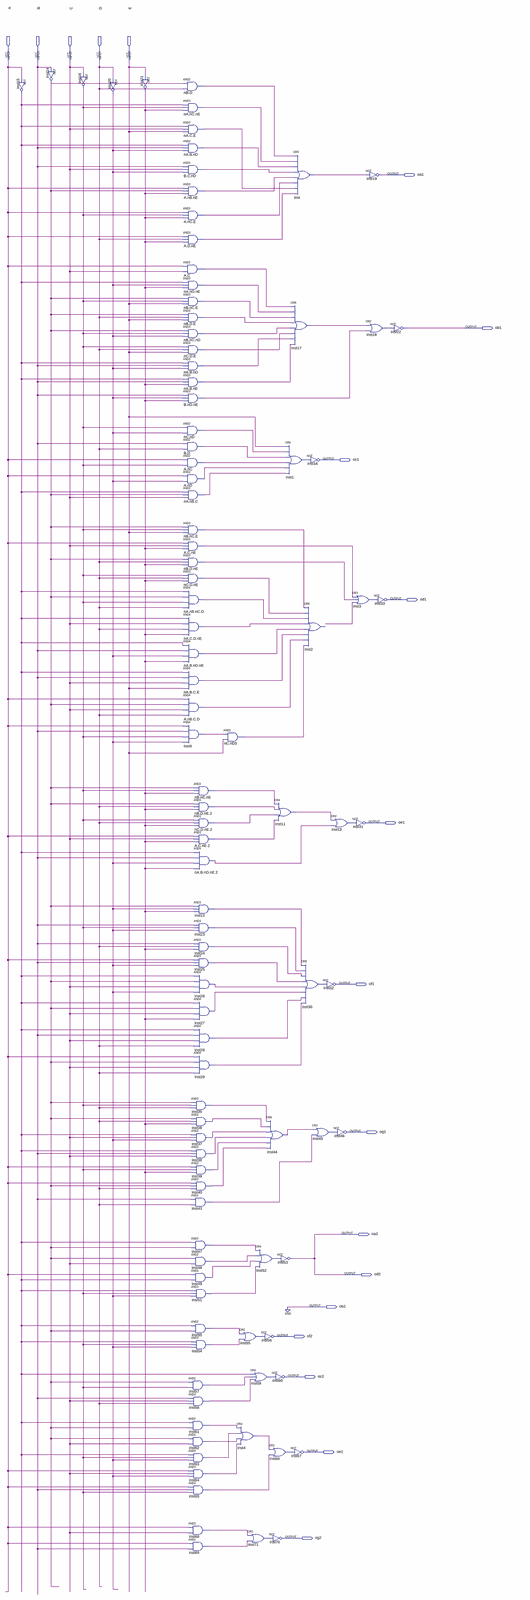
[diagram p0: schematic sheet, whole]
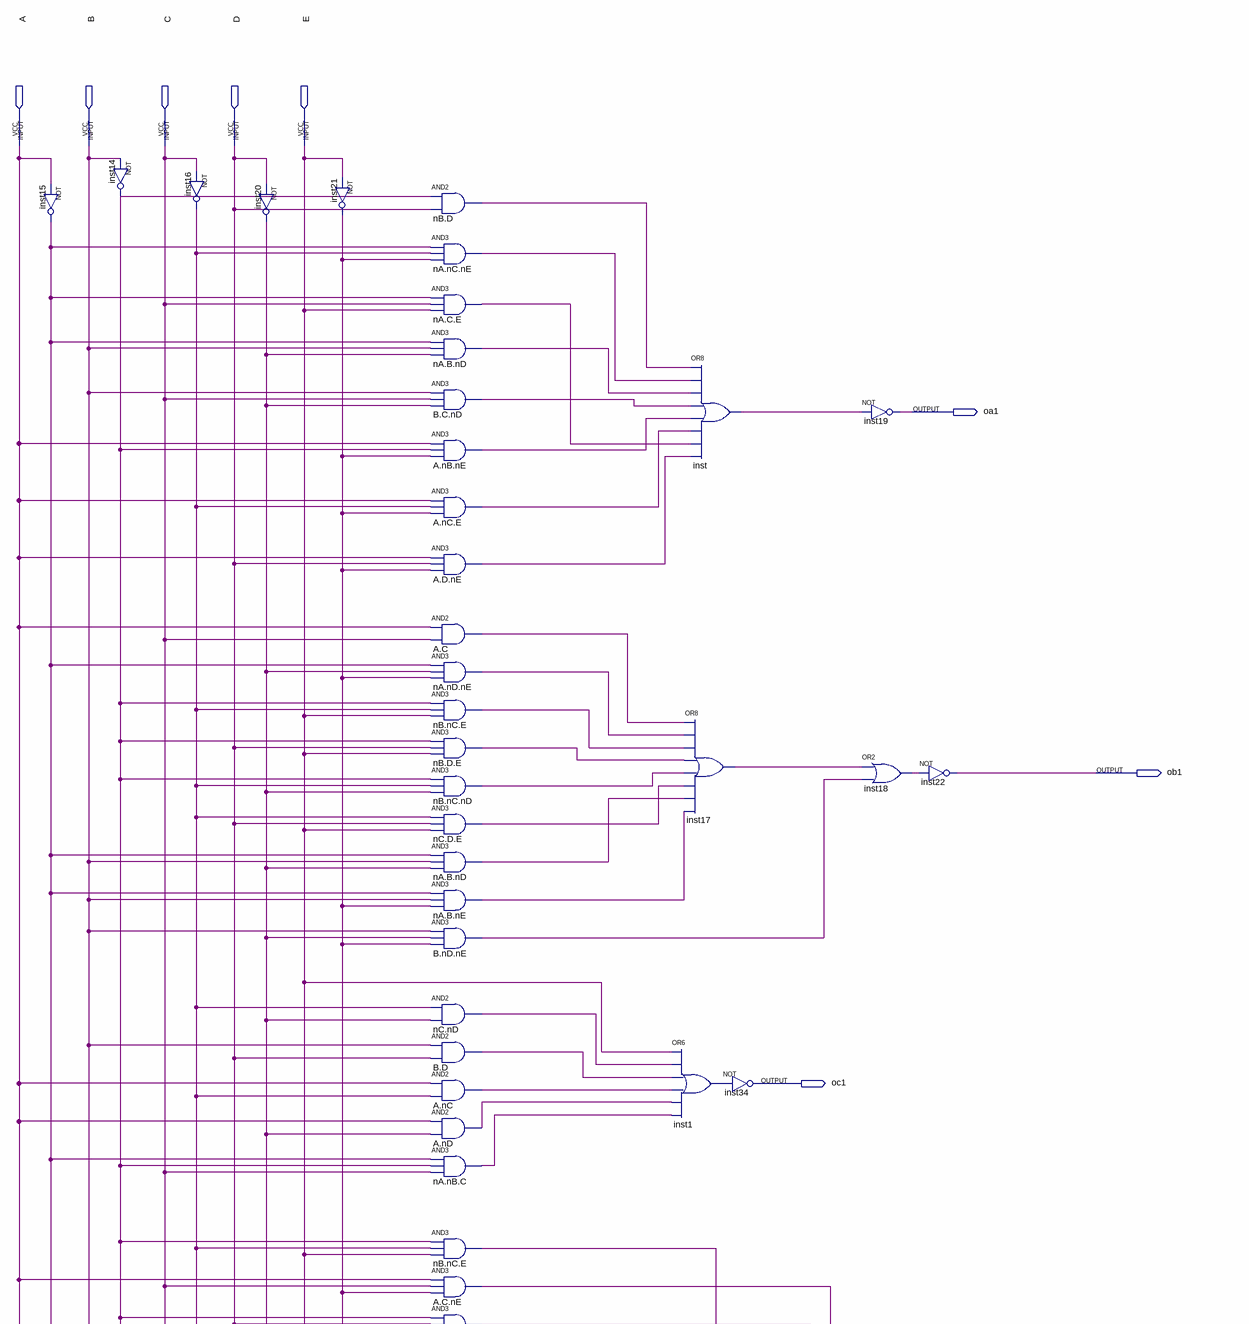
[diagram p1: schematic sheet, upper part]
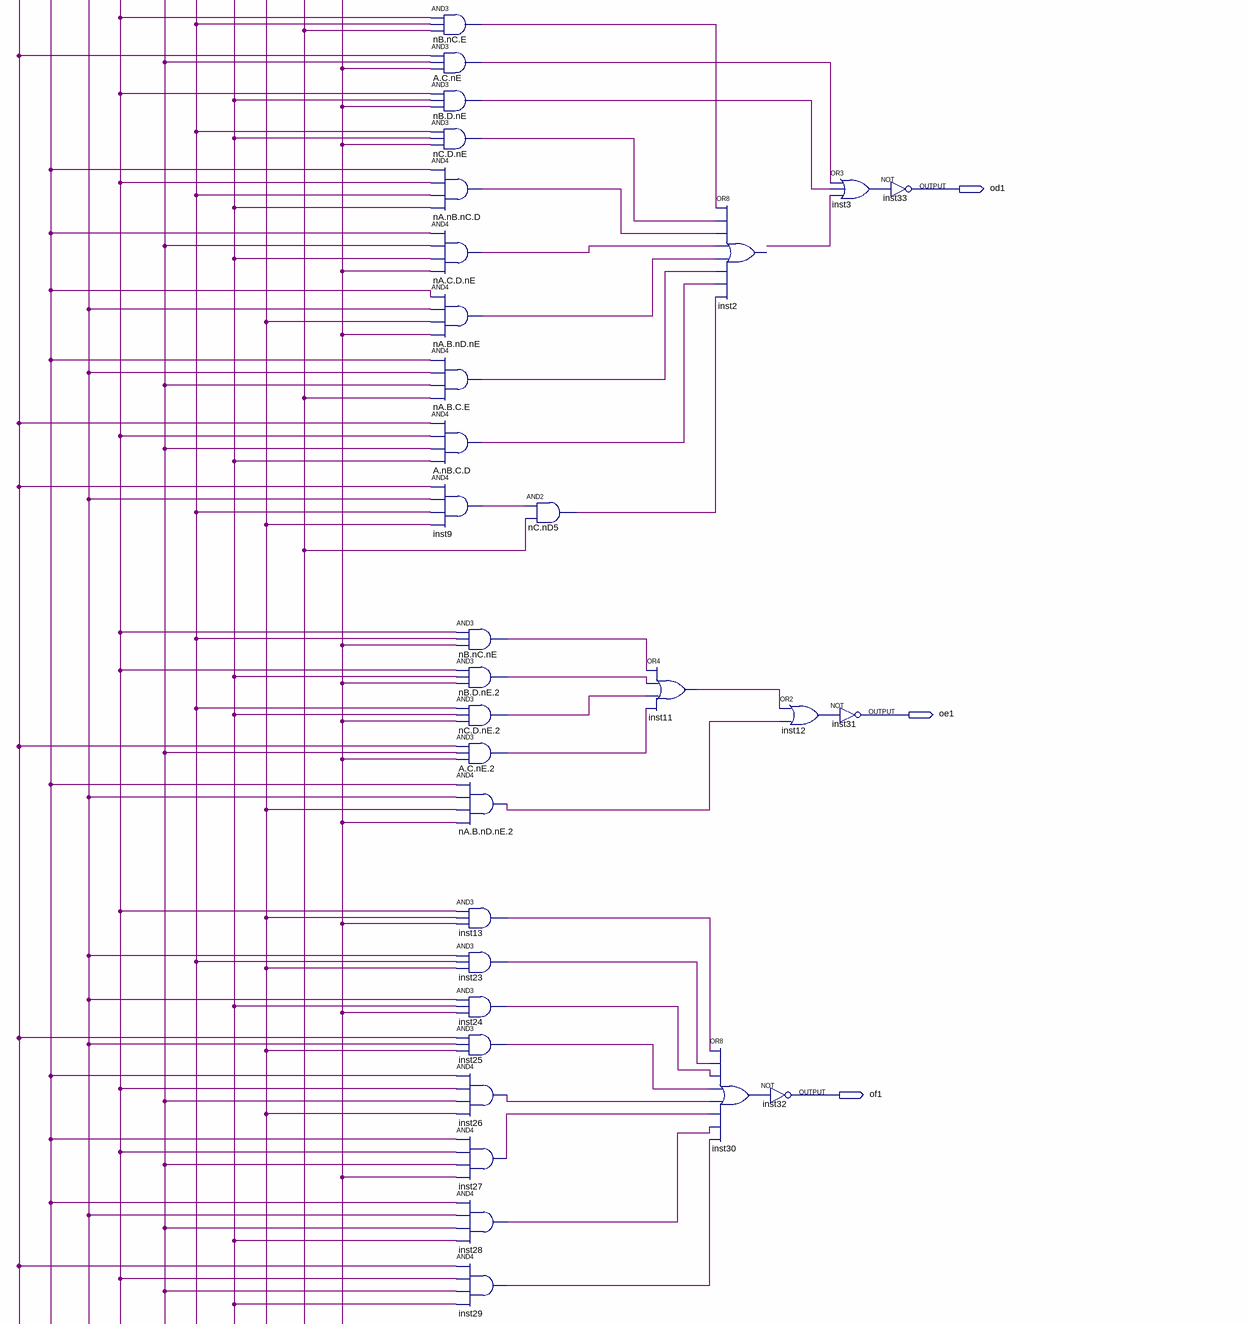
[diagram p2: schematic sheet, middle part]
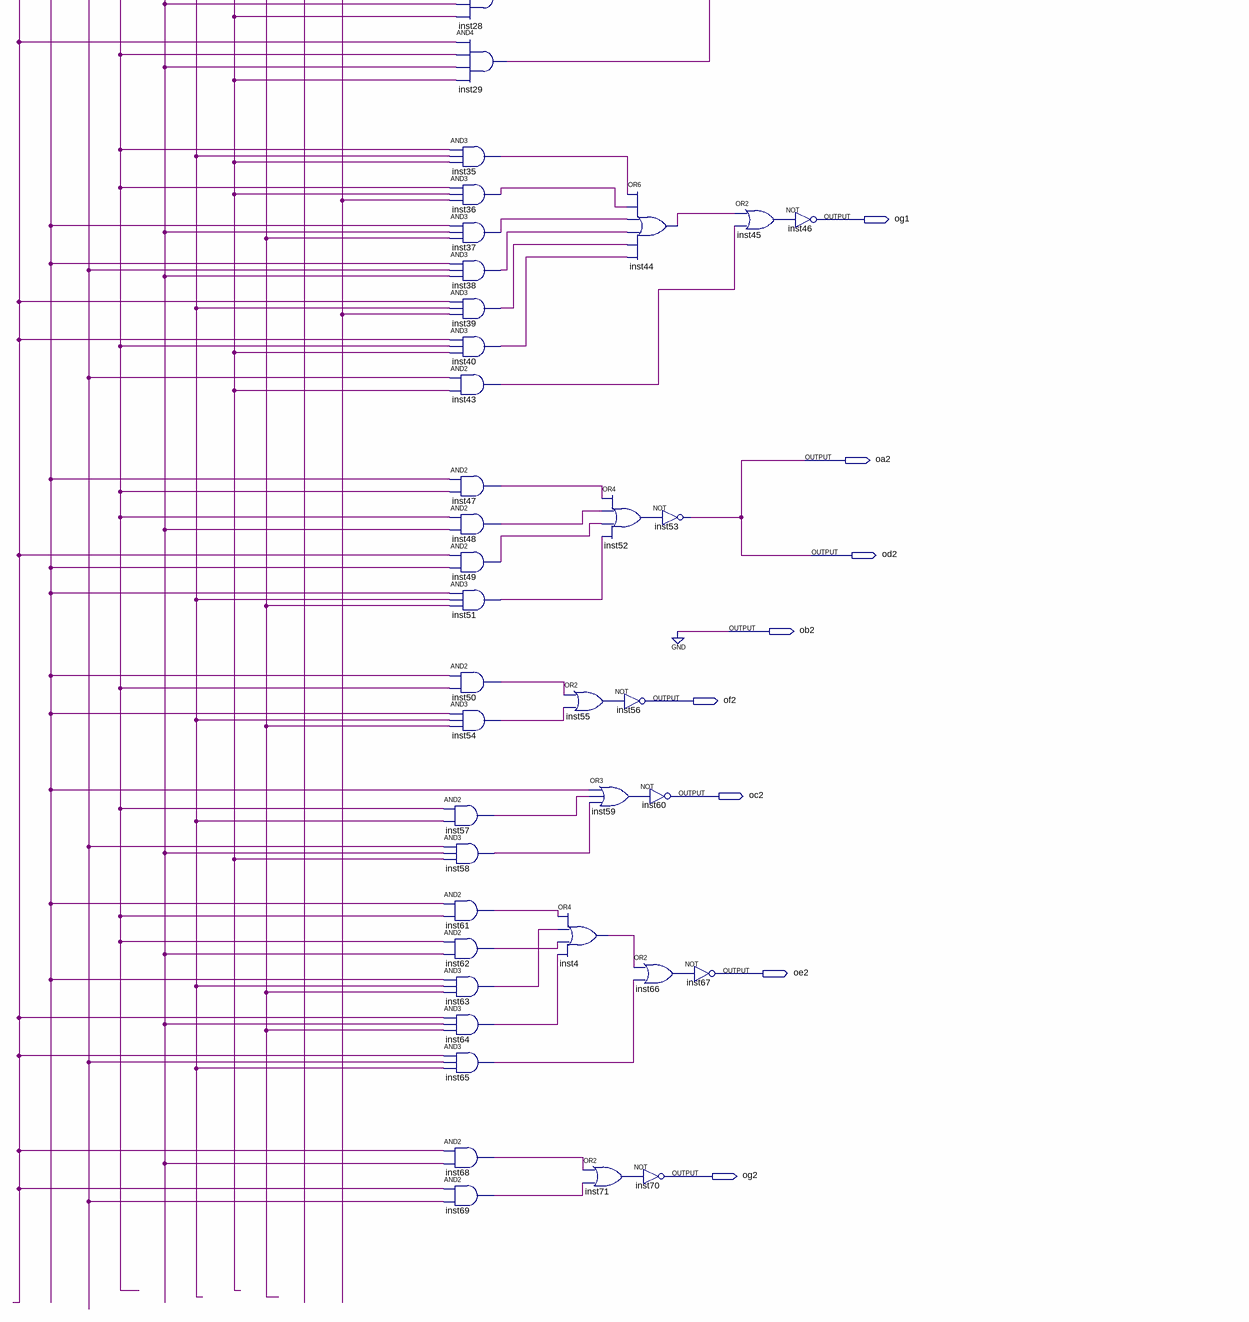
[diagram p3: schematic sheet, lower part]
// Quartus schematic bcd14segout.bdf as structural Verilog: 102 symbols, 19 pins
module bcd14segout (
  input  A,
  input  B,
  input  C,
  input  D,
  input  E,
  output oa1,
  output ob1,
  output oc1,
  output od1,
  output oe1,
  output of1,
  output og1,
  output oa2,
  output od2,
  output ob2,
  output of2,
  output oc2,
  output oe2,
  output og2
);

  wire A_C_nE_2_out, A_C_nE_out, A_C_out, A_D_nE_out, A_nB_C_D_out, A_nB_nE_out, A_nC_E_out, A_nC_out,
       A_nD_out, B_C_nD_out, B_D_out, B_nD_nE_out, inst1_out, inst3_out, inst4_out, inst9_out, inst11_out,
       inst12_out, inst13_out, inst14_out, inst15_out, inst16_out, inst17_out, inst18_out, inst20_out,
       inst21_out, inst23_out, inst24_out, inst25_out, inst26_out, inst27_out, inst28_out, inst29_out,
       inst30_out, inst35_out, inst36_out, inst37_out, inst38_out, inst39_out, inst40_out, inst43_out,
       inst44_out, inst45_out, inst47_out, inst48_out, inst49_out, inst50_out, inst51_out, inst52_out,
       inst54_out, inst55_out, inst57_out, inst58_out, inst59_out, inst61_out, inst62_out, inst63_out,
       inst64_out, inst65_out, inst66_out, inst68_out, inst69_out, inst71_out, inst_out, nA_B_C_E_out,
       nA_B_nD_nE_2_out, nA_B_nD_nE_out, nA_B_nD_out, nA_B_nD_out_2, nA_B_nE_out, nA_C_D_nE_out, nA_C_E_out,
       nA_nB_C_out, nA_nB_nC_D_out, nA_nC_nE_out, nA_nD_nE_out, nB_D_E_out, nB_D_nE_2_out, nB_D_nE_out,
       nB_D_out, nB_nC_E_out, nB_nC_E_out_2, nB_nC_nD_out, nB_nC_nE_out, nC_D_E_out, nC_D_nE_2_out,
       nC_D_nE_out, nC_nD5_out, nC_nD_out, undriven;

  not inst15 (inst15_out, A);
  not inst14 (inst14_out, B);
  not inst16 (inst16_out, C);
  not inst20 (inst20_out, D);
  not inst21 (inst21_out, E);
  and \nB.D  (nB_D_out, inst14_out, D);
  and \nA.nC.nE  (nA_nC_nE_out, inst15_out, inst16_out, inst21_out);
  and \nA.C.E  (nA_C_E_out, inst15_out, C, E);
  and \nA.B.nD  (nA_B_nD_out, inst15_out, B, inst20_out);
  and \B.C.nD  (B_C_nD_out, B, C, inst20_out);
  and \A.nB.nE  (A_nB_nE_out, A, inst14_out, inst21_out);
  and \A.nC.E  (A_nC_E_out, A, inst16_out, inst21_out);
  and \A.D.nE  (A_D_nE_out, A, D, inst21_out);
  and \A.C  (A_C_out, A, C);
  and \nA.nD.nE  (nA_nD_nE_out, inst15_out, inst20_out, inst21_out);
  and \nB.nC.E  (nB_nC_E_out, inst14_out, inst16_out, E);
  and \nB.D.E  (nB_D_E_out, inst14_out, D, E);
  and \nB.nC.nD  (nB_nC_nD_out, inst14_out, inst16_out, inst20_out);
  and \nC.D.E  (nC_D_E_out, inst16_out, D, E);
  and \nA.B.nD_dup2  (nA_B_nD_out_2, inst15_out, B, inst20_out);
  and \nA.B.nE  (nA_B_nE_out, inst15_out, B, inst21_out);
  and \B.nD.nE  (B_nD_nE_out, B, inst20_out, inst21_out);
  and \nC.nD  (nC_nD_out, inst16_out, inst20_out);
  and \B.D  (B_D_out, B, D);
  and \A.nC  (A_nC_out, A, inst16_out);
  and \A.nD  (A_nD_out, A, inst20_out);
  and \nA.nB.C  (nA_nB_C_out, inst15_out, inst14_out, C);
  and \nB.nC.E_dup2  (nB_nC_E_out_2, inst14_out, inst16_out, E);
  and \A.C.nE  (A_C_nE_out, A, C, inst21_out);
  and \nB.D.nE  (nB_D_nE_out, inst14_out, D, inst21_out);
  and \nC.D.nE  (nC_D_nE_out, inst16_out, D, inst21_out);
  and \nA.nB.nC.D  (nA_nB_nC_D_out, inst15_out, inst14_out, inst16_out, D);
  and \nA.C.D.nE  (nA_C_D_nE_out, inst15_out, C, D, inst21_out);
  and \nA.B.nD.nE  (nA_B_nD_nE_out, inst15_out, B, inst20_out, inst21_out);
  and \nA.B.C.E  (nA_B_C_E_out, inst15_out, B, C, E);
  and \A.nB.C.D  (A_nB_C_D_out, A, inst14_out, C, D);
  and inst9 (inst9_out, A, B, inst16_out, inst20_out);
  and \nB.nC.nE  (nB_nC_nE_out, inst14_out, inst16_out, inst21_out);
  and \nB.D.nE.2  (nB_D_nE_2_out, inst14_out, D, inst21_out);
  and \nC.D.nE.2  (nC_D_nE_2_out, inst16_out, D, inst21_out);
  and \A.C.nE.2  (A_C_nE_2_out, A, C, inst21_out);
  and \nA.B.nD.nE.2  (nA_B_nD_nE_2_out, inst15_out, B, inst20_out, inst21_out);
  and inst13 (inst13_out, inst14_out, inst20_out, inst21_out);
  and inst23 (inst23_out, B, inst16_out, inst20_out);
  and inst24 (inst24_out, B, D, inst21_out);
  and inst25 (inst25_out, A, B, inst20_out);
  and inst26 (inst26_out, inst15_out, inst14_out, C, inst20_out);
  and inst27 (inst27_out, inst15_out, inst14_out, C, inst21_out);
  and inst28 (inst28_out, inst15_out, B, C, D);
  and inst29 (inst29_out, A, inst14_out, C, D);
  and inst35 (inst35_out, inst14_out, inst16_out, D);
  and inst36 (inst36_out, inst14_out, D, inst21_out);
  and inst37 (inst37_out, inst15_out, C, inst20_out);
  and inst38 (inst38_out, inst15_out, B, C);
  and inst39 (inst39_out, A, inst16_out, inst21_out);
  and inst40 (inst40_out, A, inst14_out, D);
  and inst43 (inst43_out, B, D);
  and inst47 (inst47_out, inst15_out, inst14_out);
  and inst48 (inst48_out, inst14_out, C);
  and inst49 (inst49_out, A, inst15_out);
  and inst51 (inst51_out, inst15_out, inst16_out, inst20_out);
  and inst50 (inst50_out, inst15_out, inst14_out);
  and inst54 (inst54_out, inst15_out, inst16_out, inst20_out);
  and inst57 (inst57_out, inst14_out, inst16_out);
  and inst58 (inst58_out, B, C, D);
  and inst61 (inst61_out, inst15_out, inst14_out);
  and inst62 (inst62_out, inst14_out, C);
  and inst63 (inst63_out, inst15_out, inst16_out, inst20_out);
  and inst64 (inst64_out, A, C, inst20_out);
  and inst65 (inst65_out, A, B, inst16_out);
  and inst68 (inst68_out, A, C);
  and inst69 (inst69_out, A, B);
  and \nC.nD5  (nC_nD5_out, inst9_out, E);
  or inst55 (inst55_out, inst50_out, inst54_out);
  or inst4 (inst4_out, inst61_out, inst63_out, inst62_out, inst64_out);
  or inst71 (inst71_out, inst68_out, inst69_out);
  or inst44 (inst44_out, inst35_out, inst36_out, inst37_out, inst38_out, inst39_out, inst40_out);
  or inst52 (inst52_out, inst47_out, inst48_out, inst49_out, inst51_out);
  not inst56 (of2, inst55_out);
  or inst59 (inst59_out, inst15_out, inst57_out, inst58_out);
  or inst66 (inst66_out, inst4_out, inst65_out);
  not inst70 (og2, inst71_out);
  or inst17 (inst17_out, A_C_out, nA_nD_nE_out, nB_nC_E_out, nB_D_E_out, nB_nC_nD_out, nC_D_E_out, nA_B_nD_out_2, nA_B_nE_out);
  or inst1 (inst1_out, E, nC_nD_out, B_D_out, A_nC_out, A_nD_out, nA_nB_C_out);
  or inst11 (inst11_out, nB_nC_nE_out, nB_D_nE_2_out, nC_D_nE_2_out, A_C_nE_2_out);
  not inst53 (oa2, inst52_out);
  not inst60 (oc2, inst59_out);
  not inst67 (oe2, inst66_out);
  or inst (inst_out, nB_D_out, nA_nC_nE_out, nA_B_nD_out, B_C_nD_out, A_nB_nE_out, A_nC_E_out, nA_C_E_out, A_D_nE_out);
  not inst34 (oc1, inst1_out);
  // OR8 inst2 has open pins: IN1=nB_nC_E_out_2, IN2=nC_D_nE_out, IN3=nA_nB_nC_D_out, IN4=nA_C_D_nE_out, IN5=nA_B_nD_nE_out, IN6=nA_B_C_E_out, IN7=A_nB_C_D_out, IN8=nC_nD5_out, OUT=open
  or inst30 (inst30_out, inst13_out, inst23_out, inst24_out, inst25_out, inst26_out, inst27_out, inst28_out, inst29_out);
  or inst45 (inst45_out, inst44_out, inst43_out);
  or inst12 (inst12_out, inst11_out, nA_B_nD_nE_2_out);
  not inst32 (of1, inst30_out);
  not inst46 (og1, inst45_out);
  or inst3 (inst3_out, A_C_nE_out, nB_D_nE_out, undriven);
  not inst31 (oe1, inst12_out);
  not inst19 (oa1, inst_out);
  or inst18 (inst18_out, inst17_out, B_nD_nE_out);
  not inst33 (od1, inst3_out);
  not inst22 (ob1, inst18_out);

  assign ob2 = 1'b0;
  assign od2 = oa2;
endmodule
